# Altium schematic sheet Sch1.SchDoc
size A; SheetNumber: 1; SheetTotal: 2
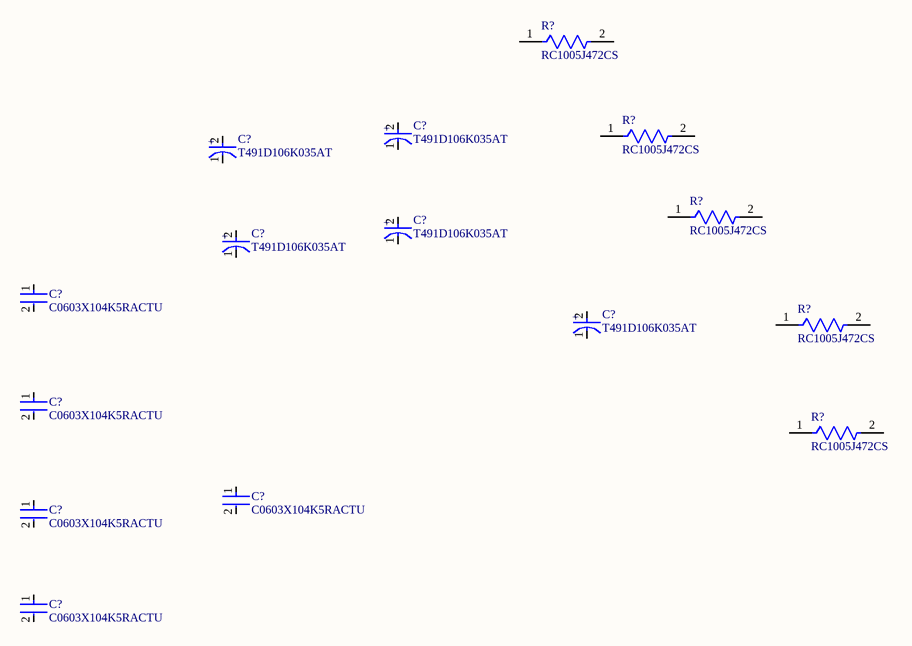
[diagram p0: Sch1.SchDoc]

## Parts
(Parts that share a designator on the sheet are numbered #1, #2 ... from top to bottom, then left to right.)
C?#1  T491D106K035AT  [FP-T491D106K035AT-MFG]
C?#2  T491D106K035AT  [FP-T491D106K035AT-MFG]
C?#3  T491D106K035AT  [FP-T491D106K035AT-MFG]
C?#4  T491D106K035AT  [FP-T491D106K035AT-MFG]
C?#5  C0603X104K5RACTU  [FP-C0603-CJ-MFG]
C?#6  T491D106K035AT  [FP-T491D106K035AT-MFG]
C?#7  C0603X104K5RACTU  [FP-C0603-CJ-MFG]
C?#8  C0603X104K5RACTU  [FP-C0603-CJ-MFG]
C?#9  C0603X104K5RACTU  [FP-C0603-CJ-MFG]
C?#10  C0603X104K5RACTU  [FP-C0603-CJ-MFG]
R?#1  RC1005J472CS  [FP-RC1005-IPC_C]
R?#2  RC1005J472CS  [FP-RC1005-IPC_C]
R?#3  RC1005J472CS  [FP-RC1005-IPC_C]
R?#4  RC1005J472CS  [FP-RC1005-IPC_C]
R?#5  RC1005J472CS  [FP-RC1005-IPC_C]

## Nets

Not connected (* = marked no-connect by the designer): C?#1 1(C) 2(A); C?#2 1(C) 2(A); C?#3 1(C) 2(A); C?#4 1(C) 2(A); C?#5 1 2; C?#6 1(C) 2(A); C?#7 1 2; C?#8 1 2; C?#9 1 2; C?#10 1 2; R?#1 1 2; R?#2 1 2; R?#3 1 2; R?#4 1 2; R?#5 1 2

## Notes on the sheet
- (in symbol CMP-2000-07580-2) +

## Library data of the parts
C?#1-C?#4 C?#6 = CMP-2000-07580-2: CAP TANT 10UF 10% 35V 2917; Dissipation Factor: 6%; Life (Hours): 2000Hour; Leakage Current: 3.5uA; Polarity: Polar; ESR (Equivalent Series Resistance): 1R; Tolerance: 20%; Dielectric Material: Tantalum; Lead Free: Lead Free; Termination: SMD/SMT; Length: 7.3mm; Voltage: 35V; Height: 2.8mm; Depth: 4.3mm; Case/Package: 2917; Height - Seated (Max): 0.122inch; Max Operating Temperature: 125°C; Package Quantity: 1; Mount: Surface Mount; REACH SVHC: No SVHC; Min Operating Temperature: -55°C; Voltage Rating (DC): 35V; Radiation Hardening: No; Features: General Purpose; Width: 4.3mm; RoHS Compliant: Yes; Capacitance: 10uF; Packaging: Tape and Reel; Case Code (Metric): 7343; Voltage Rating: 35V; Case Code (Imperial): 2917; Number of Pins: 2
C?#5 C?#7-C?#10 = CMP-2006-03300-2: CAP CER 0.1UF 50V X7R 0603; Manufacturer: Kemet; Description: Ceramic Chip Capacitor 0.1µF ±10% 50V; Capacitance: 100nF; Material: Ceramic; Tolerance: 10%; Value: 100nF; Temperature Coefficient: 15%; Temperature Range High: +125°C; Temperature Range Low: -55°C; Manufacturer Part Number: C0603X104K5RACTU; Voltage: 50V; ComponentLink2Description: Datasheet; RoHS: TRUE; ComponentLink2URL: https://content.kemet.com/datasheets/KEM_C1013_X7R_FT-CAP_SMD.pdf; Device Class L3: Ceramic Capacitors; Device Class L2: Capacitors; Package: C0603-CJ; Height: 0.95mm; Device Class L1: Passive Components; Temperature Characteristic: X7R; Lead Free: Yes; Digikey Description: CAP CER 0.1UF 50V X7R 0603; Automotive: No; Mouser Description: Capacitor; Ceramic; Cap 0.1uF; Tol+10%; SMT; Flexible Termination; Vol-Rtg 50V; TR; Temperature: -55°C to +125°C; Octopart: https://octopart.com/c0603x104k5ractu-kemet-9145062; Category: Cap; Voltage Rating: 50V; Ipc Land Pattern Name: CAPC16080X80
R?#1-R?#5 = CMP-13261-005440-1: Res Thick Film 0402 4.7kΩ 5% 0.063W ±100ppm/°C Molded SMD T/R; Power Rating: 63mW; Resistance: 4.7kR; Voltage Rating (DC): 50V; Depth: 0.5mm; Length: 1mm; Package Quantity: 1; Composition: Thick Film; Temperature Coefficient: 100ppm/°C; Case Code (Metric): 1005; Mount: Surface Mount; Lead Free: Lead Free; Features: Moisture Resistant; Max Power Dissipation: 63mW; Tolerance: 5%; Height: 0.016inch; Case Code (Imperial): 0402; Packaging: Tape and Reel; Min Operating Temperature: -55°C; Radiation Hardening: No; Contact Plating: Tin; Case/Package: 0402; Width: 0.02inch; Military Standard: Not; Max Operating Temperature: 125°C; Number of Terminations: 2